# Altium schematic sheet High_Side_Switch.SchDoc
size B; DocumentNumber: 4; SheetNumber: 4; SheetTotal: 4
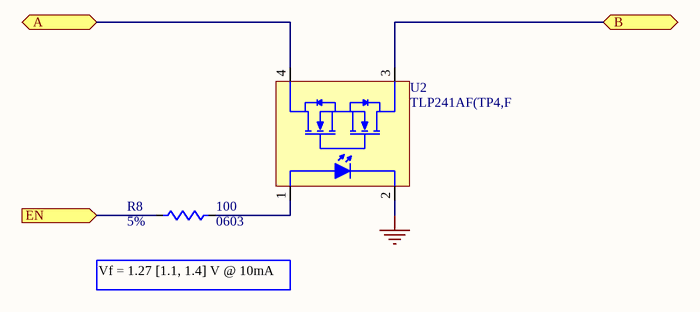
[diagram p0: High_Side_Switch.SchDoc]

## Parts
R8  value 100  Tolerance: 5%  Package: 0603  [RESC1508X09N]  (hidden comment: RES)
U2  Manufacturer Part Number 1: TLP241AF(TP4,F  [SOP254P1000X425-4N_TLP241AF]  (hidden comment: SSR_SPST-NO)

## Ports
A (bidir), B (bidir), EN (in)

## Nets
GND: U2.2
A: U2.4 ; port A
B: U2.3 ; port B
EN: R8.1 ; port EN
NetR8_2: R8.2 U2.1

## Notes on the sheet
- (near R8) Vf = 1.27 [1.1, 1.4] V @ 10mA

## Library data of the parts
R8 = RES-SM-0218: RES 100 OHM 5% 0603; Power Rating: 0.125; Pulse-Rated: No; TPN: RES-SM-0218
U2 = SSR-0001: SSR RELAY SPST-NO 2A 0-40V; Manufacturer 1: Toshiba Semiconductor and Storage; Voltage-Input: 1.27VDC; Voltage - Load: 0V ~ 40V; On-State Resistance (Max): 150mΩ; TPN: SSR-0001; Supplier 1: Digi-Key; Supplier Part Number 1: TLP241AF(TP4FCT-ND; Current - Max Continuous: 2A; Package / Case: 4-SMD (0.400", 10.16mm); ComponentLink1URL: https://toshiba.semicon-storage.com/info/docget.jsp?did=14237&prodName=TLP241A; ComponentLink1Description: Datasheet; ComponentLink2URL: https://www.digikey.com/en/products/detail/toshiba-semiconductor-and-storage/TLP241AF-TP4-F/7652708; ComponentLink2Description: Supplier Link